# EAGLE design PCB Design (EAGLE 9.0.1)
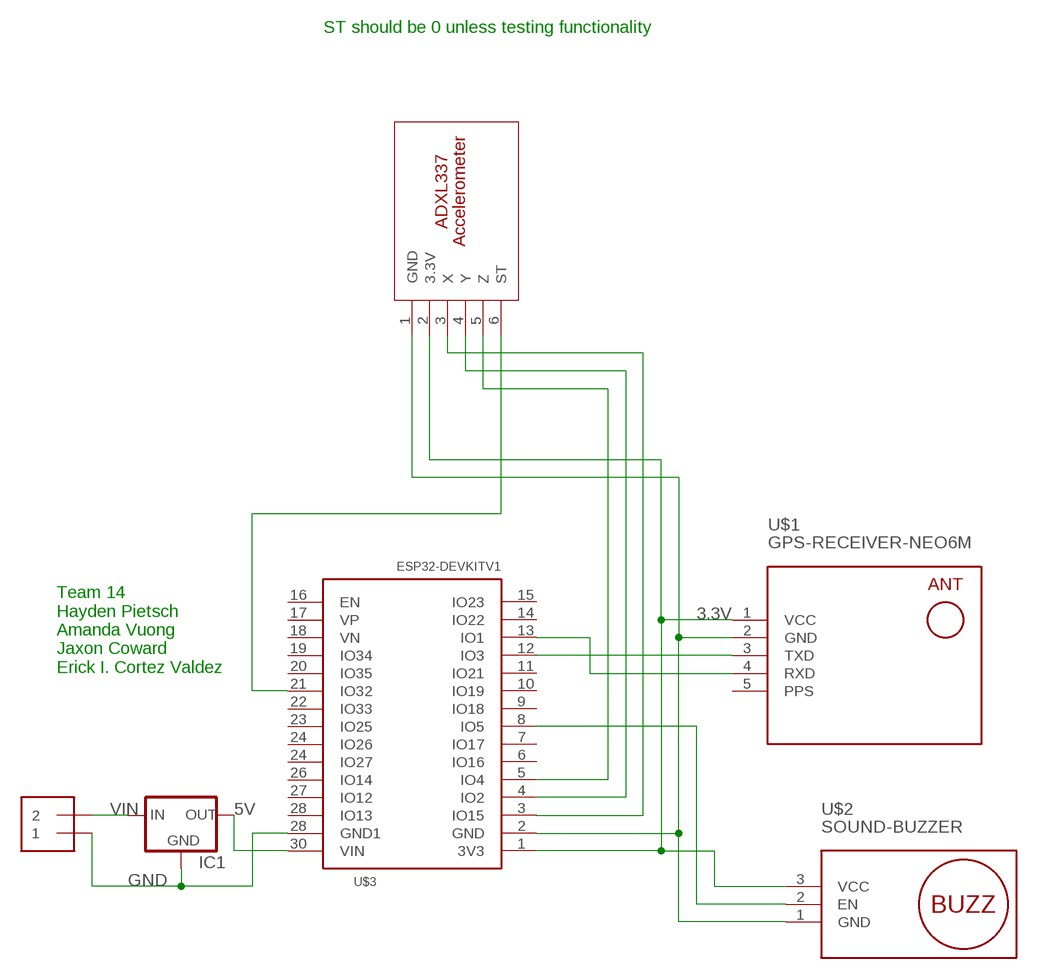
[diagram p0: schematic, sheet 1]

## Parts
IC1  V_REG_78XXSIDE  [78XXL]
J1  1X2-3.5MM  [1X2-3.5MM]
U$1  GPS-RECEIVER-NEO6M  [GPS-RECEIVER-NEO6M]
U$2  SOUND-BUZZER  [SOUND-BUZZER]
U$3  ESP32DEVKITV1  [ESP32-DEVKITV1]
U$4  ADXL337_ACCELEROMETER  [ADXL337BREAKOUT]

## Nets
3.3V [3.3V]: U$1.1(VCC) U$2.3(VCC) U$3.1(3V3) U$4.2(3.3V)
5V [5V]: IC1.OUT U$3.30(VIN)
GND [VIN]: IC1.GND J1.1 U$1.2(GND) U$2.1(GND) U$3.2(GND) U$3.28(GND1) U$4.1(GND)
N$3: U$3.21(IO32) U$4.6(ST)
N$6: U$3.3(IO15) U$4.3(X)
N$7: U$3.4(IO2) U$4.4(Y)
N$8: U$3.5(IO4) U$4.5(Z)
N$9: U$1.4(RXD) U$3.13(IO1)
N$10: U$1.3(TXD) U$3.12(IO3)
N$11: U$2.2(EN) U$3.8(IO5)
VIN [VIN]: IC1.IN J1.2
Unconnected: U$3.6(IO16) U$3.7(IO17) U$3.9(IO18) U$3.10(IO19) U$3.11(IO21) U$3.14(IO22) U$3.15(IO23) U$3.16(EN) U$3.17(VP) U$3.18(VN) U$3.19(IO34) U$3.20(IO35) U$3.22(IO33) U$3.23(IO25) U$3.24(IO26) U$3.24(IO27) U$3.26(IO14) U$3.27(IO12) U$3.28(IO13)

## Notes on the sheet
- ST should be 0 unless testing functionality
- Team 14
  Hayden Pietsch
  Amanda Vuong
  Jaxon Coward
  Erick I. Cortez Valdez

## Power pins joined to a net without a drawn wire
PPS: U$1.5(PPS)

## Library data of the parts
IC1 = SparkFun:V_REG_78XX: Voltage Regulator Standard 7805 5V regulator. IGO (Input Ground Output). Spark Fun Electronics SKU : COM-00107; MF: STMICROELECTRONICS; MPN: L7805ABV; OC_NEWARK: 34X0689
J1 = adafruit:1X2: 3.5mm Terminal block http://www.ladyada.net/library/pcb/eaglelibrary.html; OC_NEWARK: unknown
U$1 = diy-modules:GPS-RECEIVER-NEO6M: GPS Receiver Module based on NEO-6 device Short tutorial how to use NEO-6 module with Arduino: http://www.xarg.org/2016/06/neo6mv2-gps-module-with-arduino/ NEO-6 datasheet is available here: https://www.u-blox.com/sites/default/files/products/documents/NEO-6_DataSheet_%28GPS.G6-HW-09005%29.pdf Click here to find device on ebay.com <http://www.ebay.com/sch/gyneo6mv2>; MF: NEOHM - TE CONNECTIVITY; MPN: YR1B909KCC; OC_NEWARK: 98K3962
U$2 = diy-modules:SOUND-BUZZER: Sound Buzzer Module Click here to find device on ebay.com <http://www.ebay.com/sch/passive+buzzer+beep+module>; OC_NEWARK: unknown
U$3 = ESP32-DEVKITV1:ESP32DEVKITV1; OC_NEWARK: unknown
U$4 = ADXL337_Breakout:ADXL337_ACCELEROMETER; OC_NEWARK: unknown

## Net classes
0 default: width 0.203 mm, clearance 0.127 mm
1 VIN: width 0.762 mm, clearance 0.254 mm
2 3.3V: width 0.508 mm, clearance 0.254 mm
3 5V: width 0.635 mm, clearance 0.254 mm

## Board
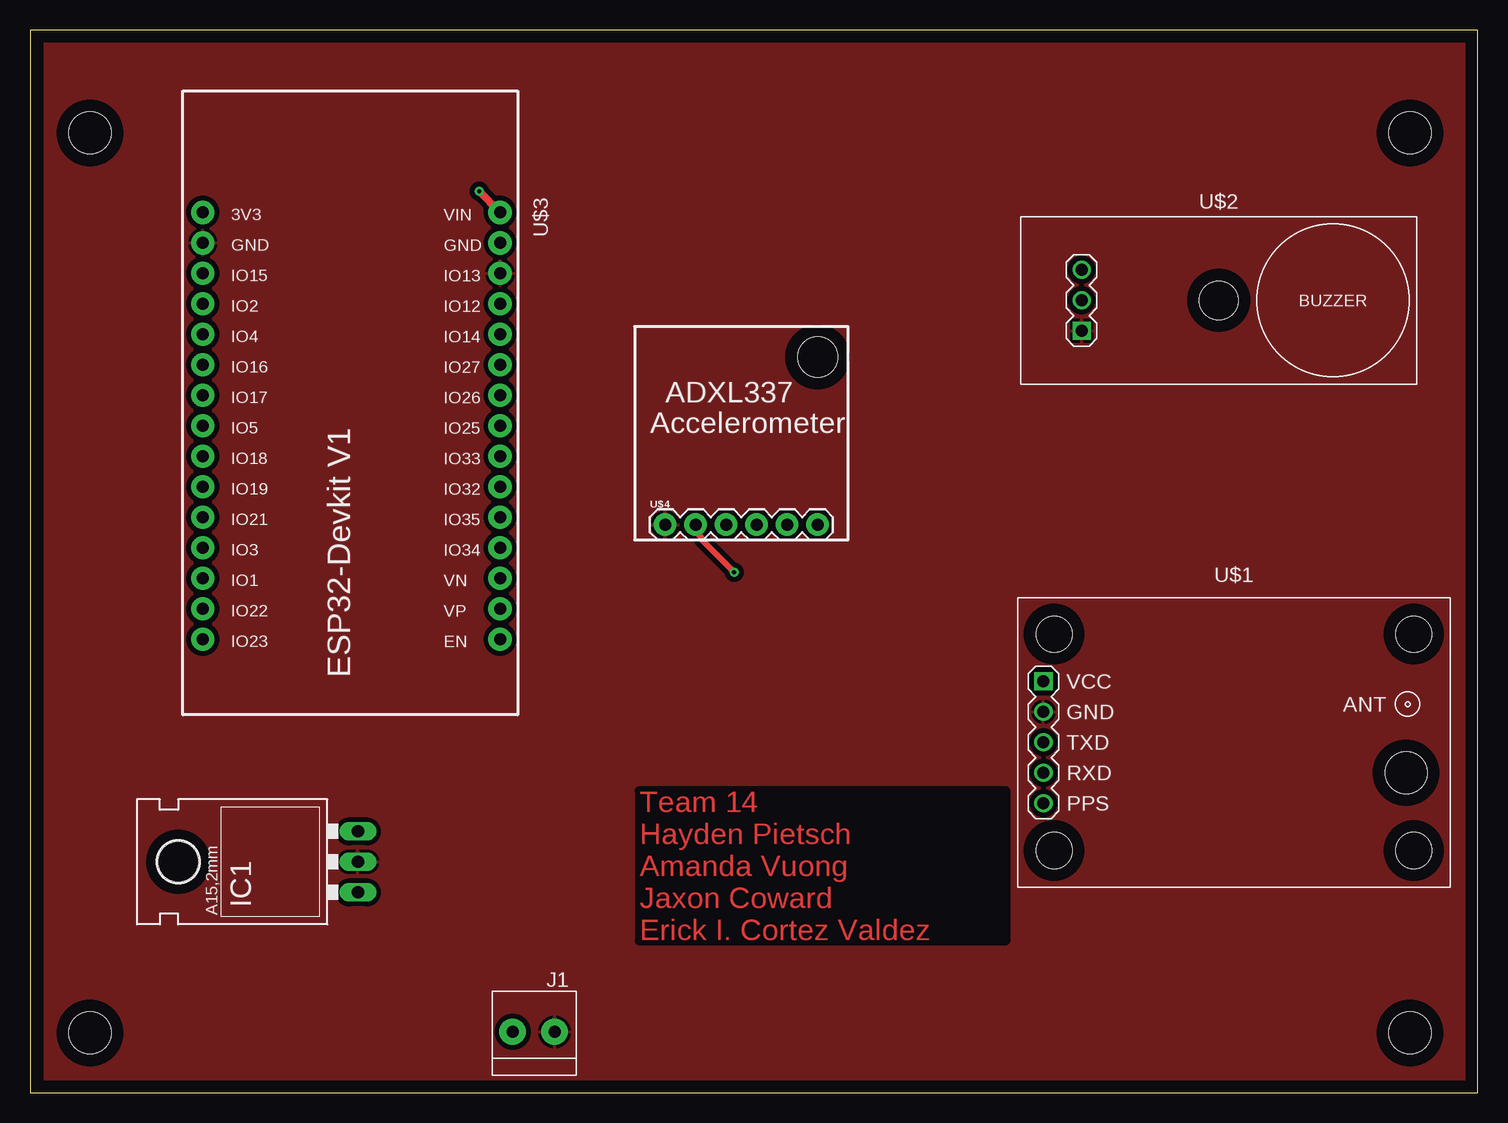
[diagram p1: board, top side]
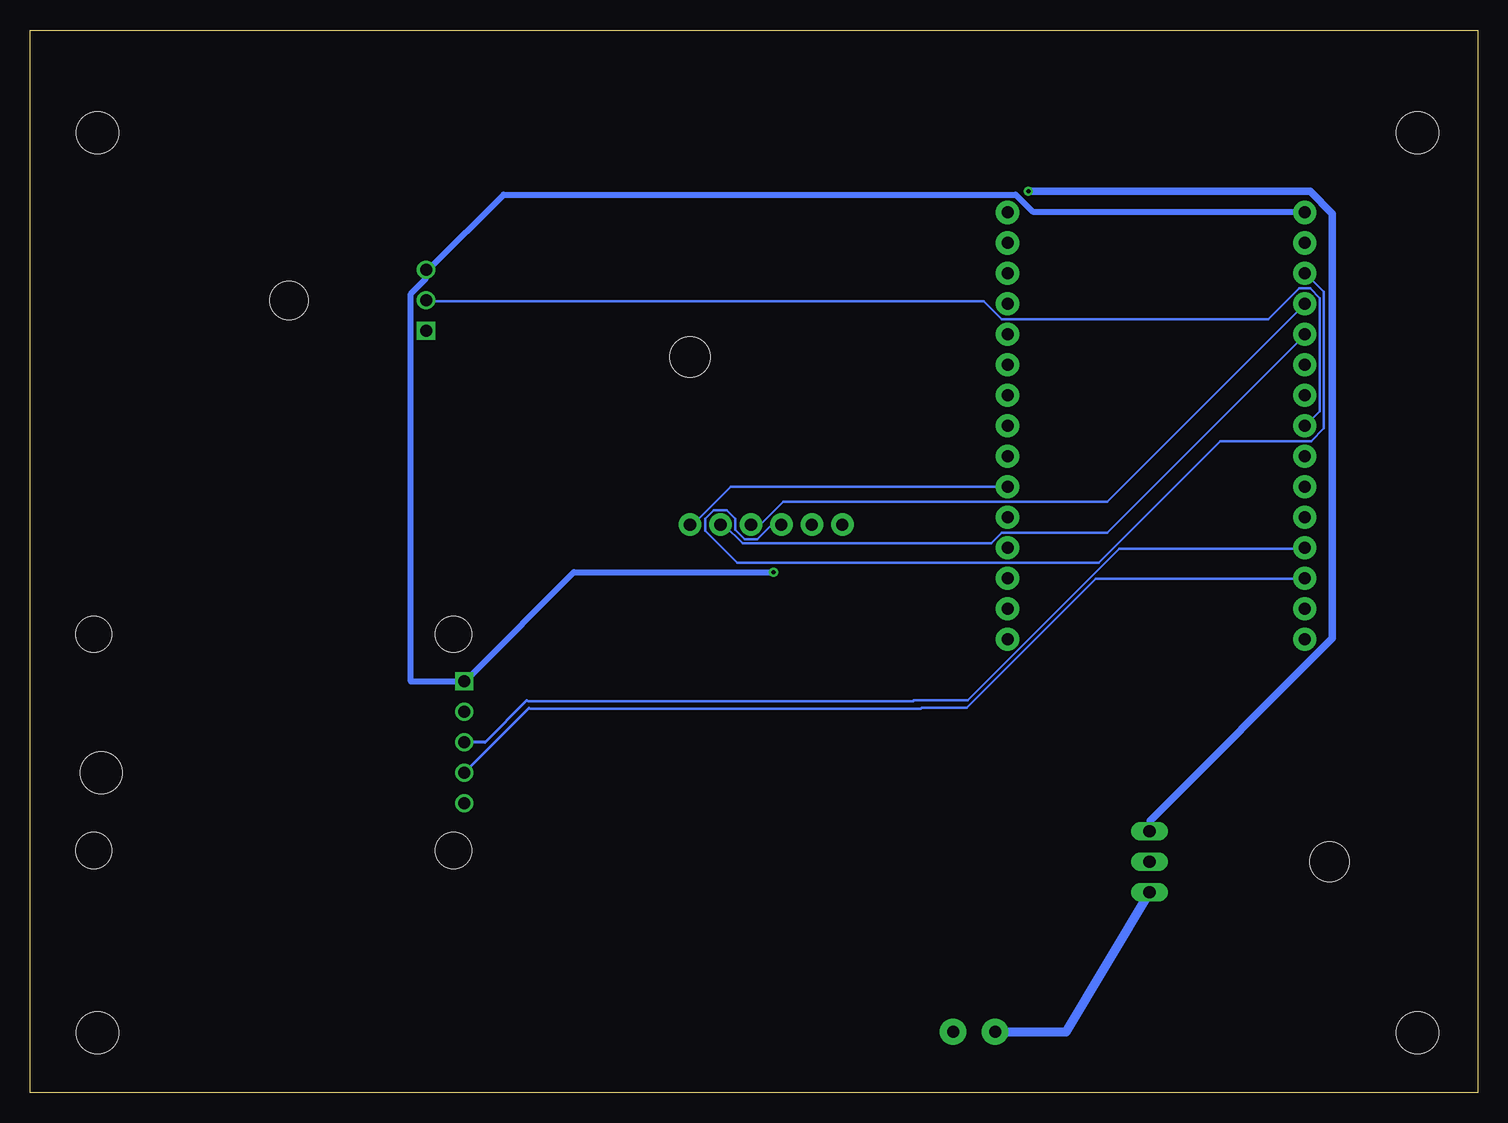
[diagram p2: board, bottom side, seen from below]

Size 120.63 x 88.57 mm. Coordinates in mm from the lower left corner, seen from the top.
Outline: 0,0 120.63,0 120.63,88.57 0,88.57 0,0
Copper layers (1*16): Top 0.035mm / dielectric 1.5mm / Bottom 0.035mm
Design rules "default": minimum track width 6mil, minimum drill 0.35mm, track to track 6mil, track to pad 6mil, pad to pad 6mil, via to via 6mil, smd to smd 6mil, copper to edge 40mil, drill to drill 6mil, minimum pad ring 10mil, minimum via ring 8mil, stop-mask expansion 4mil, vias tented up to drill 0mil, thermal gap 10mil
Holes 3.5 mm at 5,5 5,80 115,80 115,5

### Footprints (pad centres in the part's own frame; a part is rotated, then mirrored left to right if it is on the bottom)
78XXL = drill 1.016 long: GND 0,-3.81; IN -2.54,-3.81; OUT 2.54,-3.81 | hole 3.302: 0,11.176
1X2-3.5MM = drill 1 pad 2.184: 1 1.8,0; 2 -1.7,0
GPS-RECEIVER-NEO6M = drill 1 square: 1 -15.875,5.08 | drill 1: 2 -15.875,2.54; 3 -15.875,0; 4 -15.875,-2.54; 5 -15.875,-5.08 | hole 3: -14.986,9.017; -14.986,-9.017; 14.986,-9.017; 14.986,9.017 | hole 3.5: 14.351,-2.54
SOUND-BUZZER = drill 1 square: 1 -11.43,-2.54 | drill 1: 2 -11.43,0; 3 -11.43,2.54 | hole 3.2: 0,0
ESP32-DEVKITV1 = drill 1 pad 1.93: 1 -22.87,-13.54; 2 -20.33,-13.54; 3 -17.79,-13.54; 4 -15.25,-13.54; 5 -12.71,-13.54; 6 -10.17,-13.54; 7 -7.63,-13.54; 8 -5.09,-13.54; 9 -2.55,-13.54; 10 -0.01,-13.54; 11 2.53,-13.54; 12 5.07,-13.54; 13 7.61,-13.54; 14 10.15,-13.54; 15 12.69,-13.54; 16 12.69,11.23; 17 10.15,11.23; 18 7.61,11.23; 19 5.07,11.23; 20 2.53,11.23; 21 -0.01,11.23; 22 -2.55,11.23; 23 -5.09,11.23; 24 -7.63,11.23; 25 -10.17,11.23; 26 -12.71,11.23; 27 -15.25,11.23; 28 -17.79,11.23; 29 -20.33,11.23; 30 -22.87,11.23
ADXL337BREAKOUT = drill 1.016 pad 1.88: 1 2.54,1.27; 2 5.08,1.27; 3 7.62,1.27; 4 10.16,1.27; 5 12.7,1.27; 6 15.24,1.27 | hole 3.33: 15.24,15.24

### Placement (x,y rotation side)
IC1  23.52,19.25 90 top
J1  41.91,5.08 0 top
U$1  100.33,29.21 0 top
U$2  99.06,66.04 0 top
U$3  27.94,50.5 270 top
U$4  50.39,46.08 0 top

### Tracks (layer width: path | path; a pad name or v marks a point on that pad's centre or on a via)
3.3V  (via drill 0.35)
  Top 0.508: U$4.2 55.47,46.76 55.92,46.32 55.92,46.23 56.01,46.14 56.01,46.05 v58.67,43.38
  Bottom 0.508: U$1.1 88.9,34.29 88.9,66.59 87.66,67.83 87.66,68.54 U$2.3 87.39,68.63 81.17,74.85 38.49,74.85 37.07,73.43 14.4,73.43 U$3.1 | 84.3,34.45 U$1.1 | 84.1,34.58 U$1.1 | U$1.1 83.92,34.76 75.3,43.38 v58.67,43.38
5V  (via drill 0.35)
  Top 0.635: v37.43,75.12 39.12,73.43 U$3.30
  Bottom 0.635: v37.43,75.12 13.96,75.12 12.09,73.25 12.09,37.87 27.29,22.67 27.29,21.87 IC1.OUT
GND
  pour Top (isolate 0.406): 1.27,0 1.27,87.63 120.65,87.63 120.65,0
N$3
  Bottom 0.203: U$4.6 65.61,47.38 65.34,47.38 62.23,50.49 39.2,50.49 U$3.21
N$6
  Bottom 0.203: U$4.3 58.05,47.3 58.85,47.3 60.01,46.14 61.07,46.14 61.87,46.94 61.87,47.83 62.59,48.54 63.65,48.54 64.36,47.83 64.36,46.85 61.7,44.18 31.56,44.18 21.43,54.32 13.87,54.32 12.8,55.38 12.8,66.76 14.31,68.28 U$3.3
N$7
  Bottom 0.203: U$4.4 60.54,47.38 59.74,47.38 57.87,49.25 30.85,49.25 14.4,65.7 U$3.4
N$8
  Bottom 0.203: U$4.5 63.03,47.3 62.76,47.3 61.25,45.78 40.54,45.78 39.65,46.67 30.85,46.67 14.4,63.12 U$3.5
N$9
  Bottom 0.203: 79.06,32.07 78.94,32 46.41,32 46.35,32.07 46.32,32.09 42.58,32.09 31.83,42.85 14.4,42.85 U$3.13
  Bottom 0.254: 79.06,32.07 U$1.4
N$10
  Bottom 0.203: 79.22,32.7 79.12,32.63 47.03,32.63 46.99,32.7 46.94,32.72 42.49,32.72 29.87,45.34 14.4,45.34 U$3.12
  Bottom 0.254: U$1.3 82.71,29.21 79.22,32.7
N$11
  Bottom 0.203: U$2.2 87.57,65.96 41.16,65.96 39.65,64.45 17.42,64.45 14.85,67.03 13.96,67.03 13.16,66.23 13.16,56.81 14.31,55.65 U$3.8
VIN
  Bottom 0.762: IC1.IN 34.29,5.08 J1.2

### Text on the board
Top: Team 14 / Hayden Pietsch / Amanda Vuong / Jaxon Coward / Erick I. Cortez Valdez